# Altium schematic sheet 51-2001-01-18_04 Power Module Schematic.SchDoc
size 431 x 279 mm; Organization: ORGANIZATION; Address1: ADDRESS 1; Address2: ADDRESS 2; Address3: ADDRESS 3; Address4: ADDRESS 4; Revision: -; SheetNumber: 4; SheetTotal: 4; ENG_APP_DATE: --/--/--; DSN_APP_DATE: --/--/--; CHK_APP_DATE: --/--/--
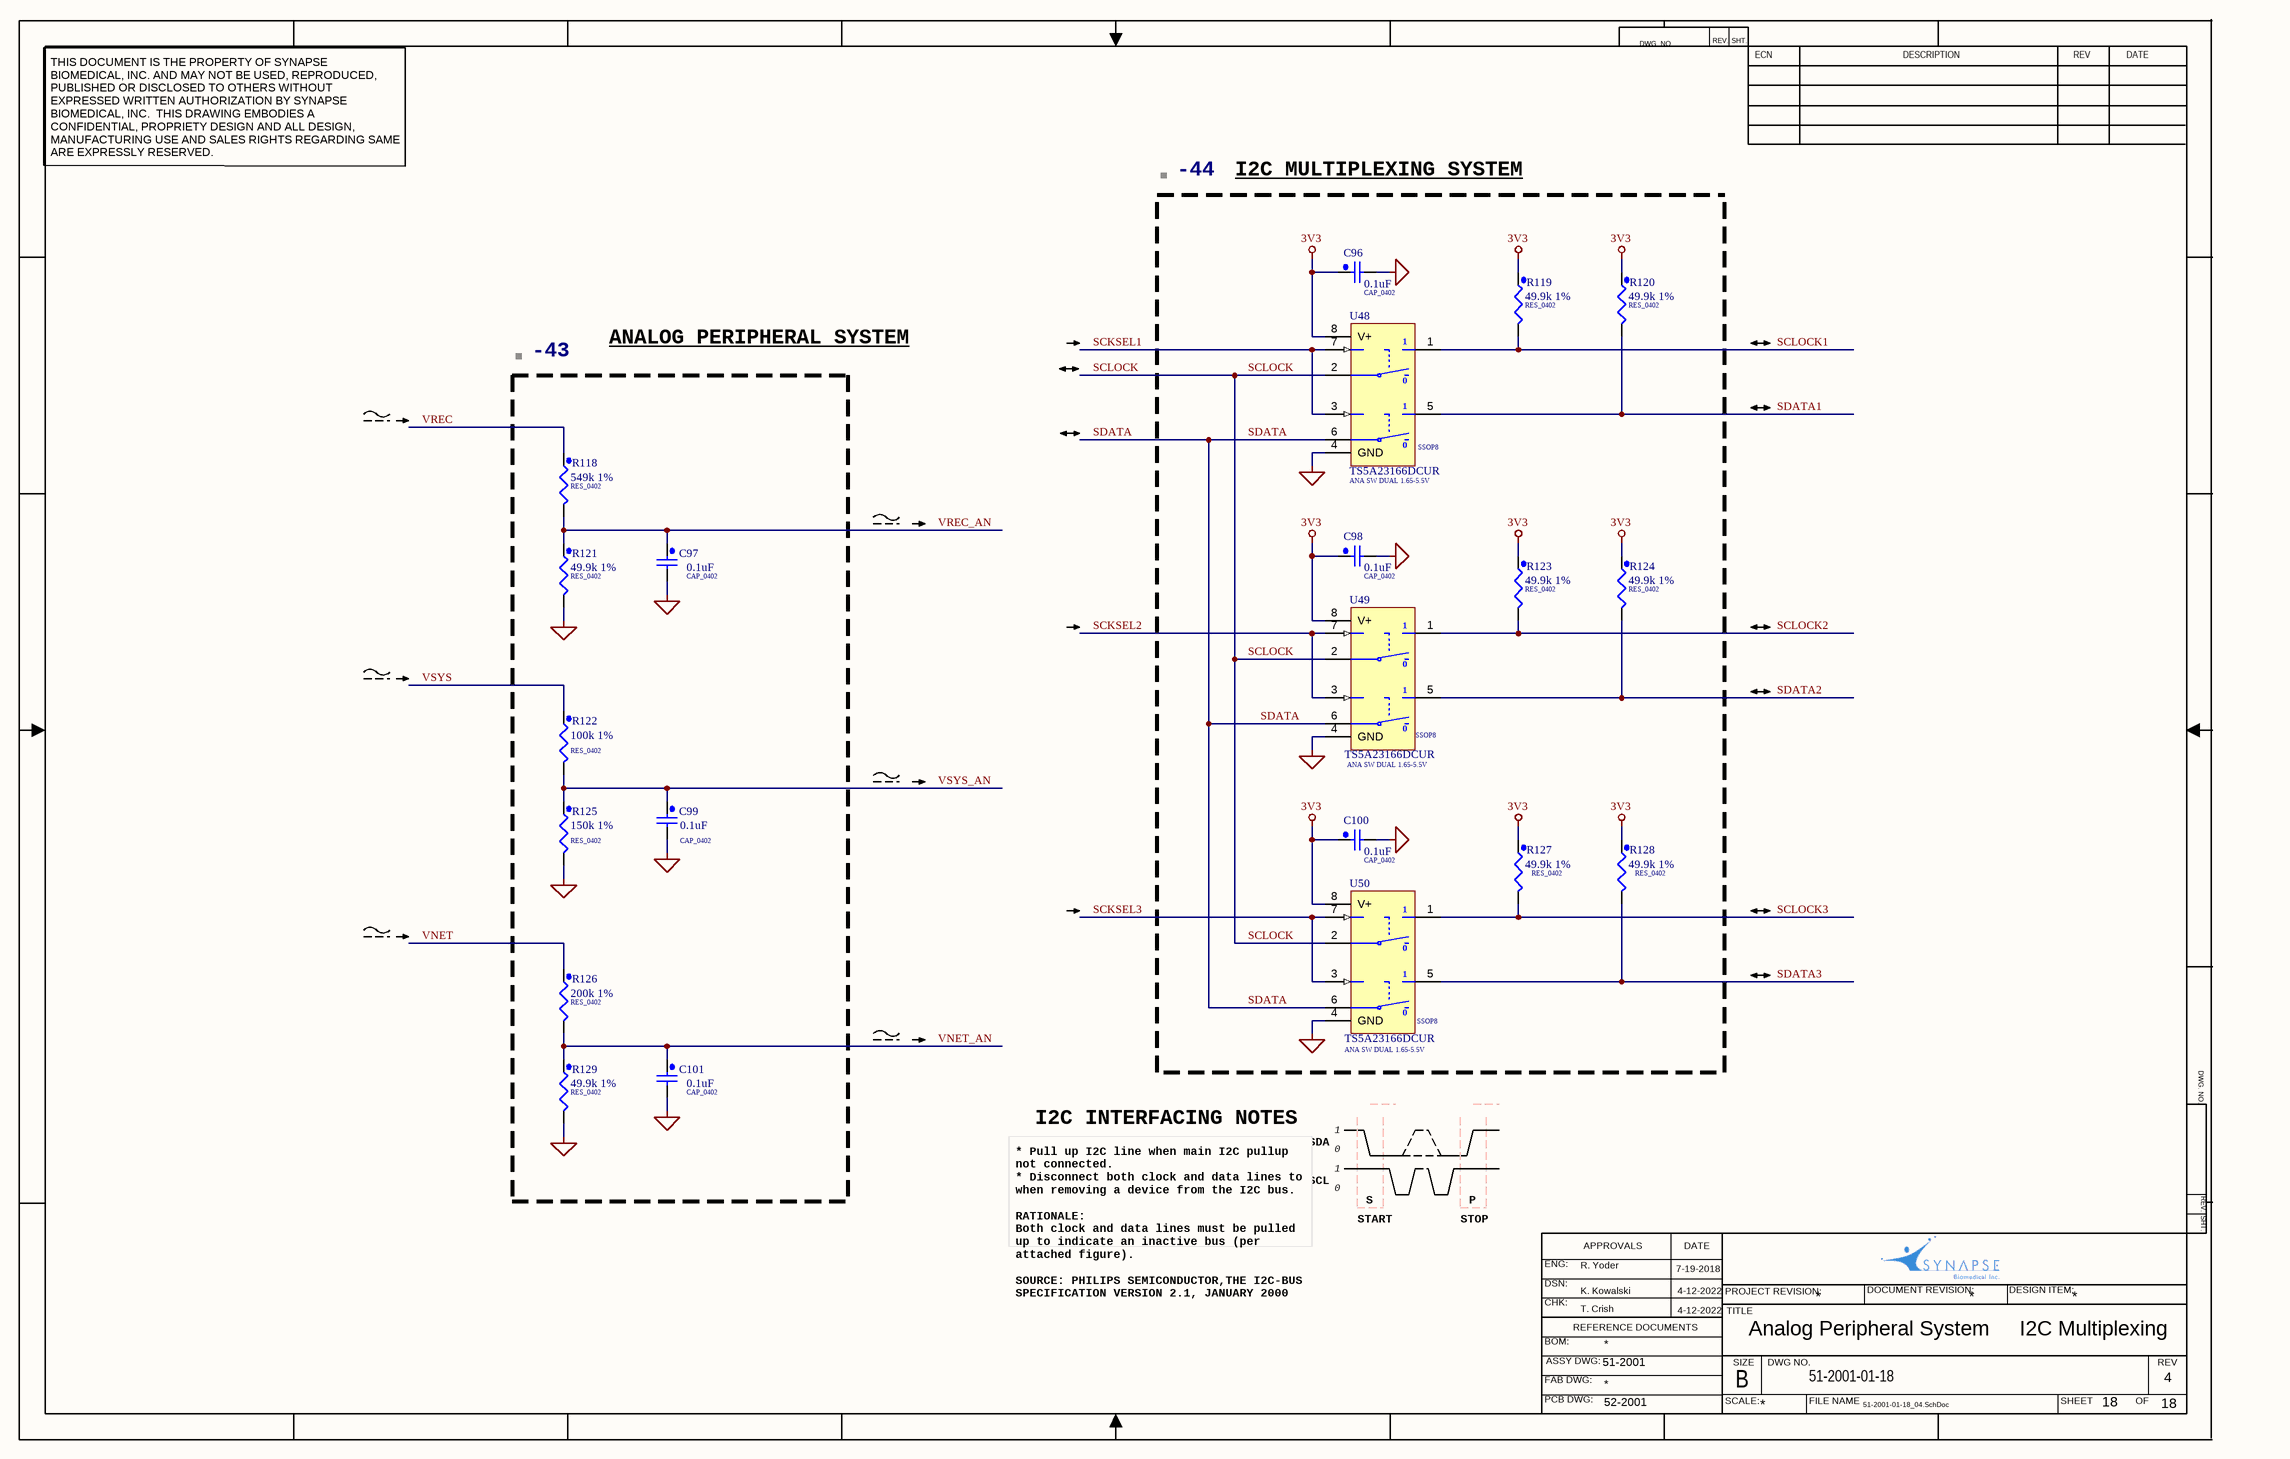
[diagram p0: 51-2001-01-18_04 Power Module Schematic.SchDoc]

## Parts
-43  XDESCRIPTION: ANALOG PERIPHERAL SYSTEM  (hidden comment: BOM_S1)  (graphical)
-44  XDESCRIPTION: I2C MULTIPLEXING SYSTEM  (hidden comment: BOM_S1)  (graphical)
C96  value 0.1uF  [CAP_0402]  (hidden comment: C_100n_X7R_16_0402_10%)
C97  value 0.1uF  [CAP_0402]  (hidden comment: C_100n_X7R_16_0402_10%)
C98  value 0.1uF  [CAP_0402]  (hidden comment: C_100n_X7R_16_0402_10%)
C99  value 0.1uF  [CAP_0402]  (hidden comment: C_100n_X7R_16_0402_10%)
C100  value 0.1uF  [CAP_0402]  (hidden comment: C_100n_X7R_16_0402_10%)
C101  value 0.1uF  [CAP_0402]  (hidden comment: C_100n_X7R_16_0402_10%)
R118  value 549k 1%  [RES_0402]  (hidden comment: R_549k_0402)
R119  value 49.9k 1%  [RES_0402]  (hidden comment: R_49k9_0402)
R120  value 49.9k 1%  [RES_0402]  (hidden comment: R_49k9_0402)
R121  value 49.9k 1%  [RES_0402]  (hidden comment: R_49k9_0402)
R122  value 100k 1%  [RES_0402]  (hidden comment: R_100k_0402)
R123  value 49.9k 1%  [RES_0402]  (hidden comment: R_49k9_0402)
R124  value 49.9k 1%  [RES_0402]  (hidden comment: R_49k9_0402)
R125  value 150k 1%  [RES_0402]  (hidden comment: R_150k_0402)
R126  value 200k 1%  [RES_0402]  (hidden comment: R_200k_0402)
R127  value 49.9k 1%  [RES_0402]  (hidden comment: R_49k9_0402)
R128  value 49.9k 1%  [RES_0402]  (hidden comment: R_49k9_0402)
R129  value 49.9k 1%  [RES_0402]  (hidden comment: R_49k9_0402)
U48  ANA SW DUAL 1.65-5.5V  PackageDescription: SSOP8  [VSSOP8]
U49  ANA SW DUAL 1.65-5.5V  PackageDescription: SSOP8  [VSSOP8]
U50  ANA SW DUAL 1.65-5.5V  PackageDescription: SSOP8  [VSSOP8]

## Nets
3V3: C96.1 C98.1 C100.1 R119.1 R120.1 R123.1 R124.1 R127.1 R128.1 U48.8(V+) U49.8(V+) U50.8(V+)
GND: C96.2 C97.2 C98.2 C99.2 C100.2 C101.2 R121.2 R125.2 R129.2 U48.4(GND) U49.4(GND) U50.4(GND)
SCKSEL1: U48.3(IN2) U48.7(IN1)
SCKSEL2: U49.3(IN2) U49.7(IN1)
SCKSEL3: U50.3(IN2) U50.7(IN1)
SCLOCK: U48.2(COM1) U49.2(COM1) U50.2(COM1)
SCLOCK1: R119.2 U48.1(NO1)
SCLOCK2: R123.2 U49.1(NO1)
SCLOCK3: R127.2 U50.1(NO1)
SDATA: U48.6(COM2) U49.6(COM2) U50.6(COM2)
SDATA1: R120.2 U48.5(NO2)
SDATA2: R124.2 U49.5(NO2)
SDATA3: R128.2 U50.5(NO2)
VNET: R126.1
VNET_AN: C101.1 R126.2 R129.1
VREC: R118.1
VREC_AN: C97.1 R118.2 R121.1
VSYS: R122.1
VSYS_AN: C99.1 R122.2 R125.1

## Notes on the sheet
- DWG. NO.
- REV.
- SHT.
- ECN
- DESCRIPTION
- REV
- DATE
- THIS DOCUMENT IS THE PROPERTY OF SYNAPSE BIOMEDICAL, INC. AND MAY NOT BE USED, REPRODUCED, PUBLISHED OR DISCLOSED TO OTHERS WITHOUT EXPRESSED WRITTEN AUTHORIZATION BY SYNAPSE BIOMEDICAL, INC.  THIS DRAWING EMBODIES A CONFIDENTIAL, PROPRIETY DESIGN AND ALL DESIGN, MANUFACTURING USE AND SALES RIGHTS REGARDING SAME ARE EXPRESSLY RESERVED.
- I2C INTERFACING NOTES
- 1
- SDA
- SCL
- 0
- S
- P
- * Pull up I2C line when main I2C pullup not connected.
  * Disconnect both clock and data lines to when removing a device from the I2C bus.
  RATIONALE:
  Both clock and data lines must be pulled up to indicate an inactive bus (per attached figure).
  SOURCE: PHILIPS SEMICONDUCTOR,THE I2C-BUS SPECIFICATION VERSION 2.1, JANUARY 2000
- START
- STOP
- ENG:
- R. Yoder
- APPROVALS
- 7-19-2018
- DSN:
- CHK:
- REFERENCE DOCUMENTS
- K. Kowalski
- T. Crish
- 4-12-2022
- PROJECT REVISION:
- TITLE
- Analog Peripheral System     I2C Multiplexing
- *
- DOCUMENT REVISION:
- DESIGN ITEM:
- BOM:
- FAB DWG:
- PCB DWG:
- ASSY DWG:
- 51-2001
- SCALE:
- SIZE
- B
- DWG NO.
- 51-2001-01-18
- FILE NAME
- SHEET
- OF
- 4
- 52-2001
- 51-2001-01-18_04.SchDoc
- 18
- (in symbol TS5A23166DCUR) 0

## Library data of the parts
-43 -44 = BOM_S1: BOM item small graphic
C96-C101 = GRM155R71C104KA88D: 0.1uF, 16V, X7R, 0402, RoHS; MFR: Murata; SBI: 53-0040-1; PackageDescription: CAP_0402; Supplier 1: Digi-Key; Supplier Part Number 1: 490-3261-2-ND; MPN: GRM155R71C104KA88D
R118 = CRCW0402549KFKED: 549k ohm, 1%, 1/16W, 0402, RoHS; MFR: Vishay; SBI: 53-0049-36; PackageDescription: RES_0402; Supplier 1: Digi-Key; Supplier Part Number 1: 541-549KLDKR-ND; MPN: CRCW0402549KFKED
R119-R121 R123 R124 R127-R129 = MCR01MZPF4992: 49.9k ohm, 1%, 1/16W, 0402, RoHS; MFR: Vishay Dale; MPN: CRCW040249K9FKED; SBI: 53-009-2; PackageDescription: RES_0402; Supplier 1: Digi-Key; Supplier Part Number 1: 541-49.9KLDKR-ND
R122 = MCR01MZPF1003: 100k ohm, 1%, 1/16W, smd, 0402, RoHS; MFR: Vishay Dale; MPN: CRCW0402100KFKED; SBI: 53-0049-7; PackageDescription: RES_0402; Supplier 1: Digi-Key; Supplier Part Number 1: 541-100KLDKR-ND
R125 = MCR01MZPF1503: 150k ohm, 1%, 1/16W, smd, 0402, RoHS; MFR: Vishay Dale; MPN: CRCW0402150KFKED; SBI: 53-0049-11; PackageDescription: RES_0402; Supplier 1: Digi-Key; Supplier Part Number 1: 541-150KLDKR-ND
R126 = MCR01MZPF2003: 200k ohm, 1%, 1/16W, 0402, RoHS; MFR: Vishay Dale; MPN: CRCW0402200KFKED; SBI: 53-0049-28; PackageDescription: RES_0402; Supplier 1: Digi-Key; Supplier Part Number 1: 541-200KLDKR-ND
U48-U50 = TS5A23166DCUR: Analog Switch, DUAL, 2-Channel, SSOP8, RoHS; MFR: Texas Instruments; SBI: 54-0108; Value: *; Supplier 1: Digi-key; Supplier Part Number 1: 296-17906-1-ND; MPN: TS5A23166DCUR